# EasyEDA schematic Omnitouch.json
TITLE: The Omnitouch; REV: 2.1; Date: 2024-03-09; Sheet: 1/1; Drawn By: Déňa; Company: The Automation Warehouse
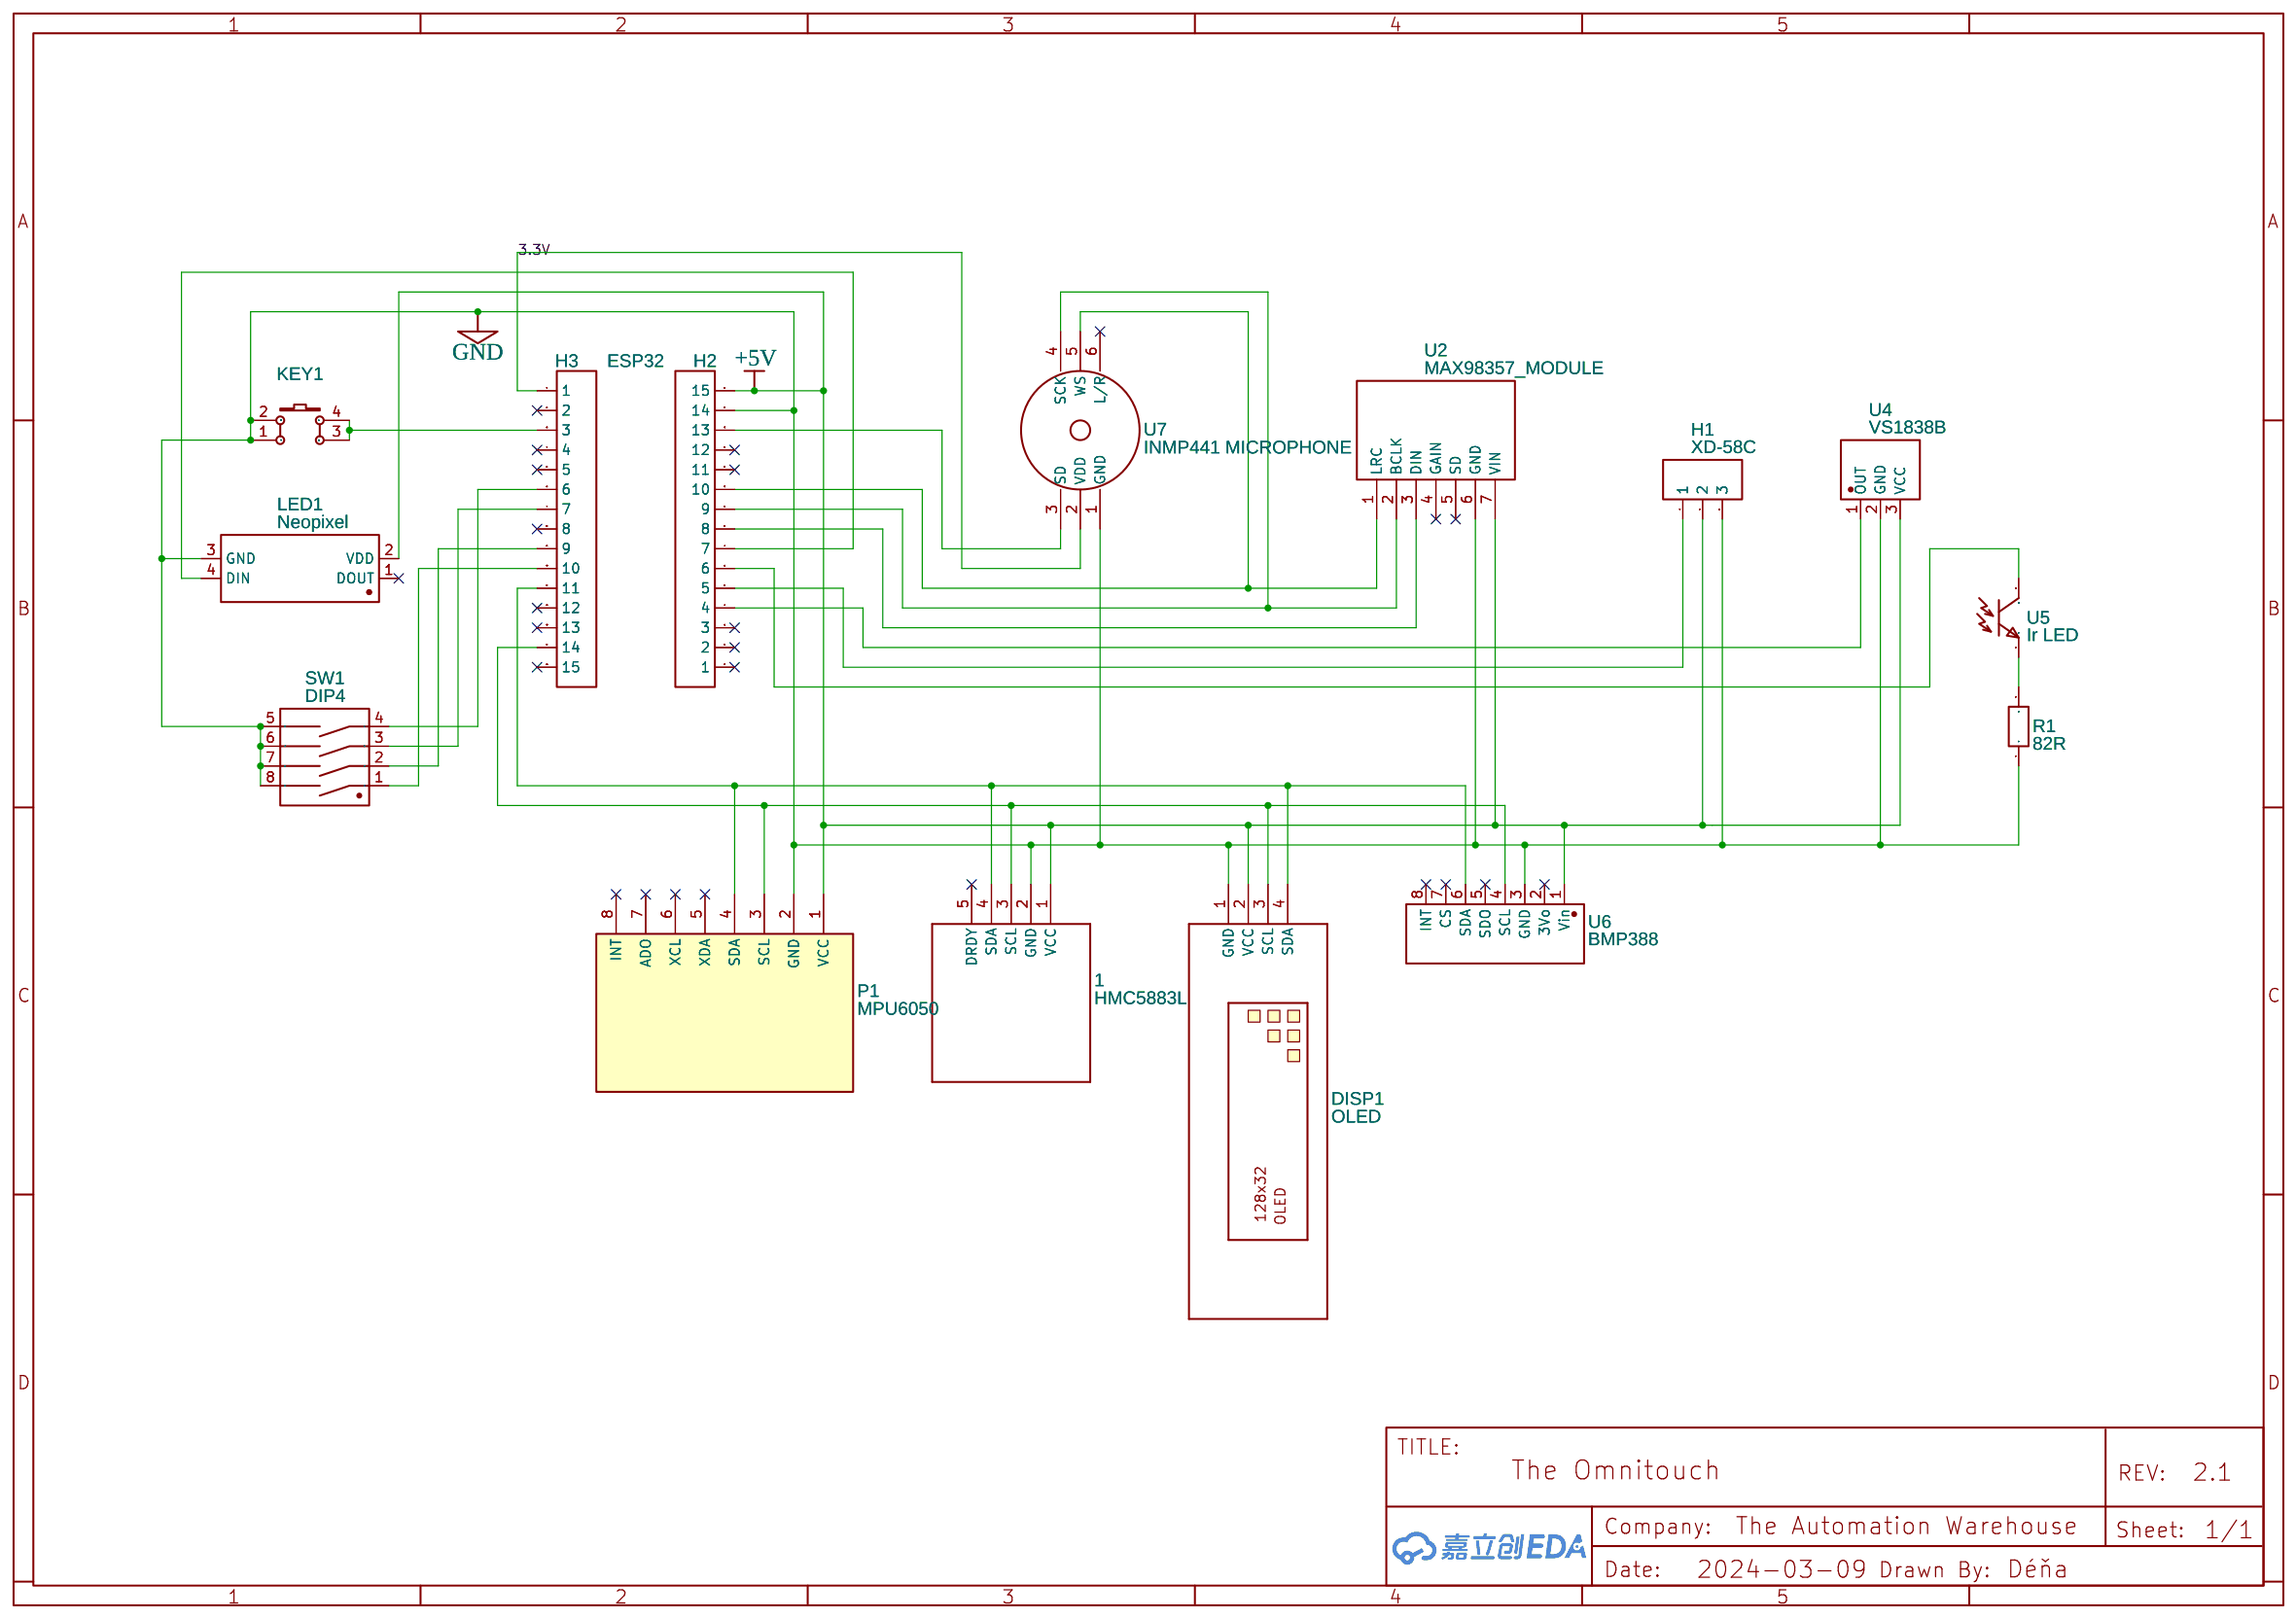
[diagram p0: schematic sheet]

## Parts
1  HMC5883L  [COMPASS-HMC5883L]
DISP1  OLED  [DISPLAY-OLED-128X32]
H1  XD-58C  [HDR-F-2.54_1X3]
H2  HDR-F-2.54_1x15  [HDR-F-2.54_1X15]
H3  ESP32  [HDR-F-2.54_1X15]
KEY1  K4-6×6_TH  [KEY-TH_4P-L6.0-W6.0-P4.50-LS6.5]
LED1  Neopixel  [LED-TH_WS2812D-F8]
P1  MPU6050  [MPU6050]
R1  82R  [R_AXIAL-0.4]
SW1  DIP4  [SW-TH_8P-L11.6-W10.0-P2.54-LS7.62]
U2  MAX98357_MODULE  [MAX98357_MODULE]
U4  VS1838B  [OPTO-TH_VS1838B]
U5  Ir LED  [LED-TH_BD5.0-P2.54-FD]
U6  BMP388  [ADAFRUIT BMP388]
U7  INMP441 MICROPHONE  [MICROPHONE INMP441]

## Library data of the parts
1 = COMPASS-HMC5883L: Contributor: Dimitri Chiminello
DISP1 = DISPLAY-OLED-128X32: Contributor: SugarFoot Pedals
H1 = HDR-F-2.54_1x3: Supplier Part: C146690; Supplier: LCSC; Contributor: LCEDA_Lib
H2 H3 = HDR-F-2.54_1x15: Supplier Part: C124408; Supplier: LCSC; Contributor: LCEDA_Lib
KEY1 = K4-6×6_TH: Supplier: LCSC; Supplier Part: C136684; Manufacturer: 韩国韩荣; Manufacturer Part: K2-1102DP-E4SW-04; Contributor: LCEDA_Lib
LED1 = WS2812D-F8: Contributor: LCSC; Supplier: LCSC; Manufacturer: worldsemi; Supplier Part: C139126; JLCPCB Part Class: Extended Part
P1 = MPU6050: sourceId: 1T5FDZYC8; Contributor: thetentheriko
R1 = R_AXIAL-0.4_EU: Contributor: LCEDA_Lib
SW1 = KF1001-04P-R0-GL-DFT-01B: Contributor: LCSC; Supplier: LCSC; Supplier Part: C976326; Manufacturer: 凯峰; JLCPCB Part Class: Extended Part
U2 = MAX98357_MODULE: Manufacturer Part: MAX98357; Supplier: ADAFRUIT; Contributor: sinth1979
U4 = VS1838B: Contributor: LCSC; Supplier: LCSC; Supplier Part: C9900002107; Manufacturer: null
U5 = PT334-6B(BY)(K): Supplier: LCSC; Supplier Part: C17179507; Manufacturer: EVERLIGHT(亿光); Contributor: lcsc
U6 = Adafruit BMP388: Contributor: telsahead
U7 = INMP441 MICROPHONE: Supplier: ebay; link: https://www.ebay.de/itm/174127178542; Contributor: cun280

## Nets
3.3V: H3.1 U7.2(VDD)
+5V: 1.1(VCC) DISP1.2(VCC) H1.2 H2.15 LED1.2(VDD) P1.1(VCC) U2.7(VIN) U4.3(VCC) U6.1(Vin)
GND: 1.2(GND) DISP1.1(GND) H1.3 H2.14 KEY1.1 KEY1.2 LED1.3(GND) P1.2(GND) R1.1 SW1.5(6) SW1.6(7) SW1.7(8) SW1.8(9) U2.6(GND) U4.2(GND) U6.3(GND) U7.1(GND)
Net-(1-3): 1.3(SCL) DISP1.3(SCL) H3.14 P1.3(SCL) U6.4(SCL)
Net-(1-4): 1.4(SDA) DISP1.4(SDA) H3.11 P1.4(SDA) U6.6(SDA)
Net-(H1-1): H1.1 H2.5
Net-(H2-4): H2.4 U4.1(OUT)
Net-(H2-6): H2.6 U5.2(C)
Net-(H2-7): H2.7 LED1.4(DIN)
Net-(H2-8): H2.8 U2.3(DIN)
Net-(H2-9): H2.9 U2.2(BCLK) U7.4(SCK)
Net-(H2-10): H2.10 U2.1(LRC) U7.5(WS)
Net-(H2-13): H2.13 U7.3(SD)
Net-(H3-3): H3.3 KEY1.3 KEY1.4
Net-(H3-6): H3.6 SW1.4
Net-(H3-7): H3.7 SW1.3
Net-(H3-9): H3.9 SW1.2
Net-(H3-10): H3.10 SW1.1
Net-(R1-2): R1.2 U5.1(E)

Not connected (* = marked no-connect by the designer): 1 5(DRDY)*; H2 1* 2* 3* 11* 12*; H3 2* 4* 5* 8* 12* 13* 15*; LED1 1(DOUT)*; P1 5(XDA)* 6(XCL)* 7(ADO)* 8(INT)*; U2 4(GAIN)* 5(SD)*; U6 2(3Vo)* 5(SDO)* 7(CS)* 8(INT)*; U7 6(L/R)*
